# EAGLE design analog-in (EAGLE 9.6.2)
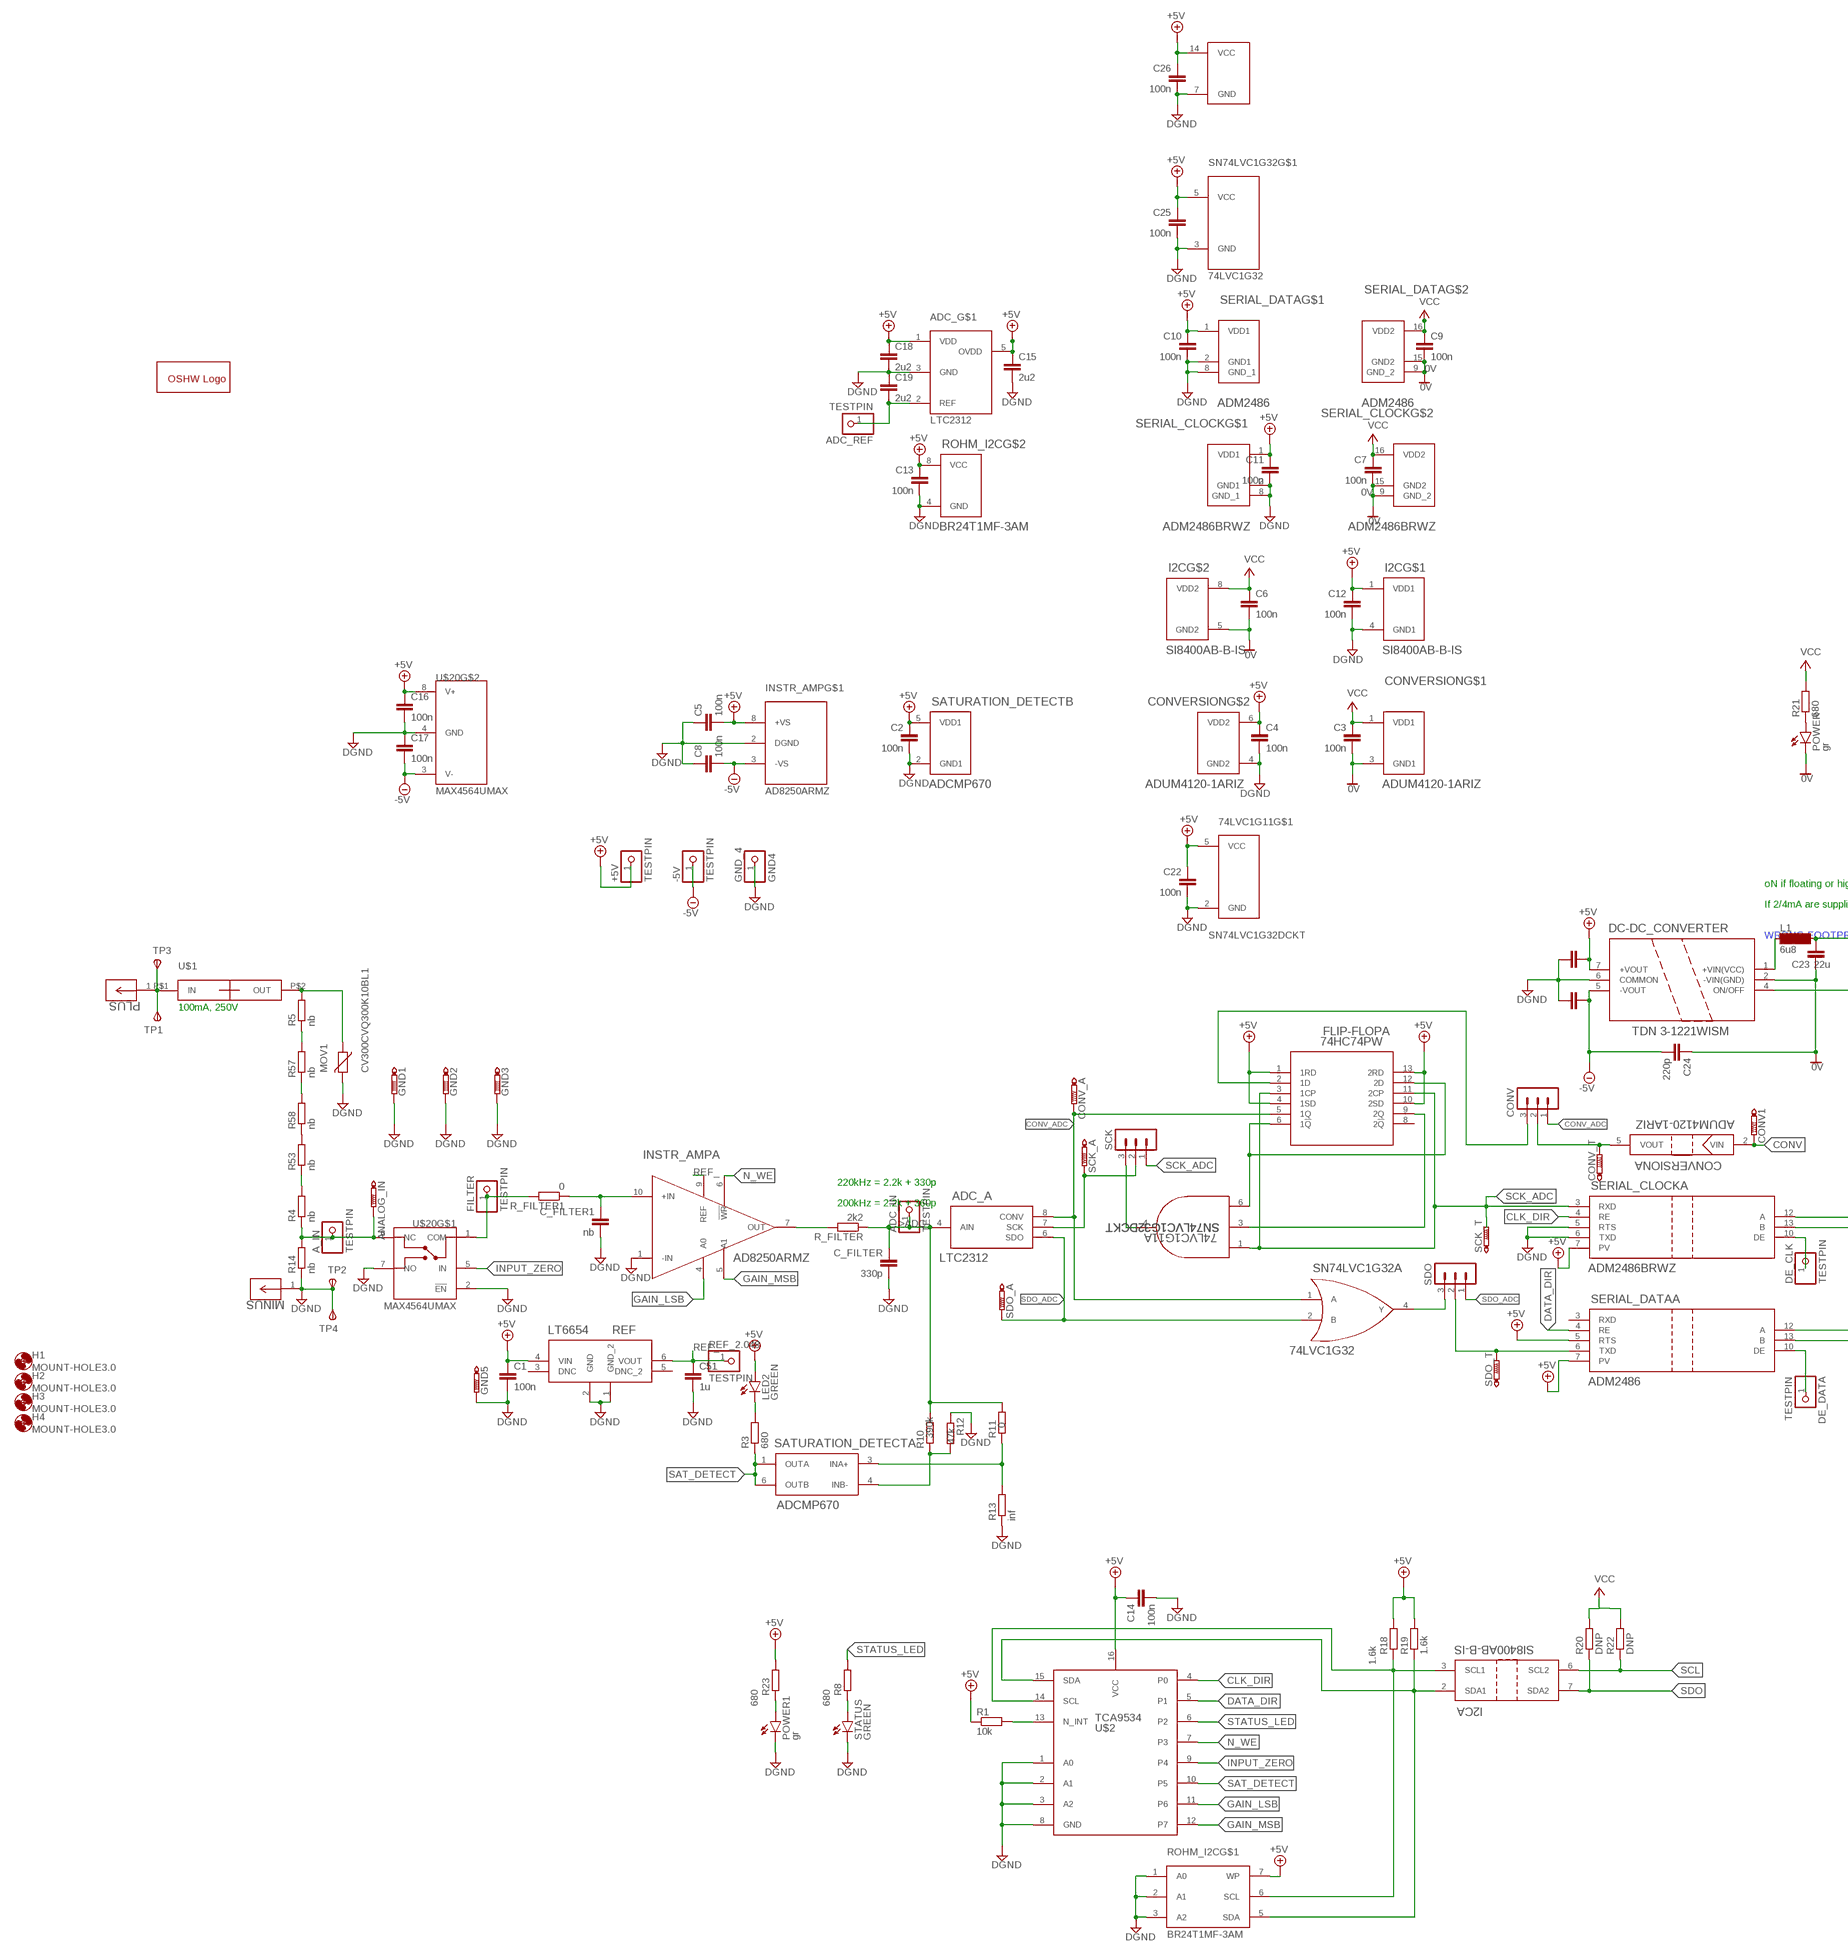
[diagram p0: schematic, sheet 1, part 1 of 2]
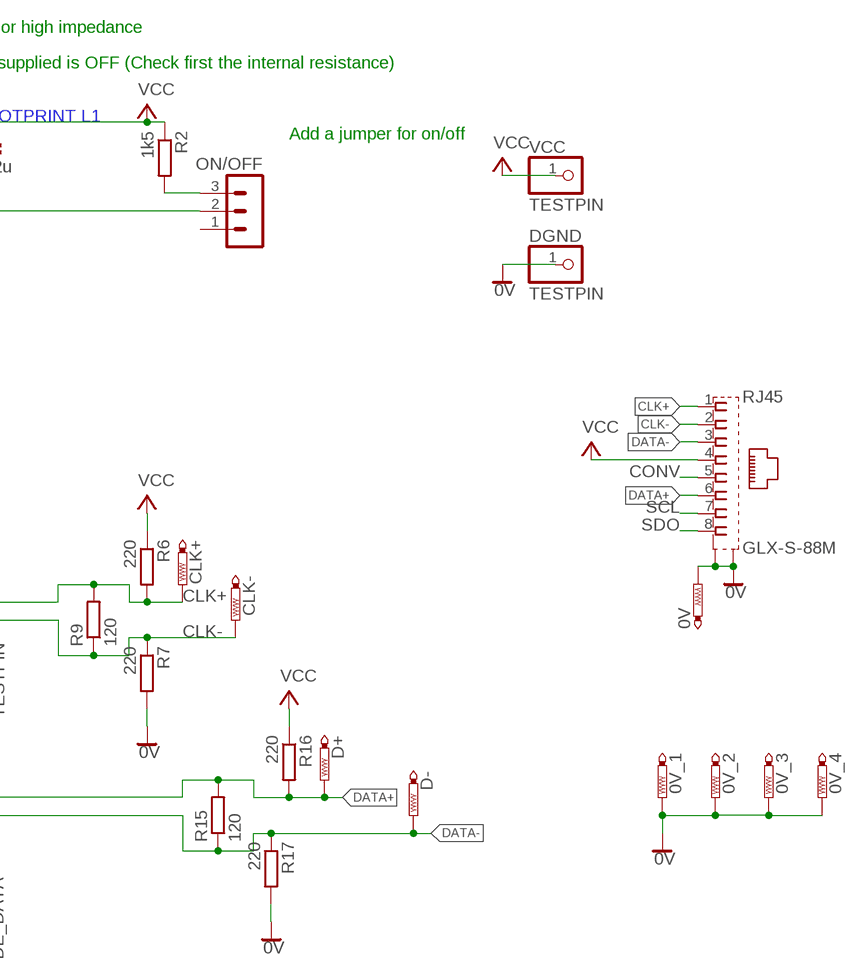
[diagram p1: schematic, sheet 1, part 2 of 2]

## Parts
0V  PTR1B1,27  [B1,27]
0V_1  PTR1B1,27  [B1,27]
0V_2  PTR1B1,27  [B1,27]
0V_3  PTR1B1,27  [B1,27]
0V_4  PTR1B1,27  [B1,27]
74LVC1G11  SN74LVC1G32DCKT  SN74LVC1G11DBVRDBV0006A_L  [DBV0006A_L]
+5V  TESTPIN  [1X01]
-5V  TESTPIN  [1X01]
A_IN  TESTPIN  [1X01]
ADC_  LTC2312  LTC2312ITS8-14TRMPBF  [TSOT-23_TS8_LIT]
ADC_IN  TESTPIN  [1X01]
ADC_REF  TESTPIN  [1X01]
ANALOG_IN  PTR1B1,27  [B1,27]
C1  100n  C-EUC0805  [C0805]
C2  100n  C-EUC0805K  [C0805K]
C3  100n  C-EUC0805K  [C0805K]
C4  100n  C-EUC0805K  [C0805K]
C5  100n  C-EUC0805K  [C0805K]
C6  100n  C-EUC0805K  [C0805K]
C7  100n  C-EUC0805K  [C0805K]
C8  100n  C-EUC0805K  [C0805K]
C9  100n  C-EUC0805K  [C0805K]
C10  100n  C-EUC0805K  [C0805K]
C11  100n  C-EUC0805K  [C0805K]
C12  100n  C-EUC0805K  [C0805K]
C13  100n  C-EUC0805K  [C0805K]
C14  100n  C-EUC0805K  [C0805K]
C15  2u2  C-EUC0805K  [C0805K]
C16  100n  C-EUC0805K  [C0805K]
C17  100n  C-EUC0805K  [C0805K]
C18  2u2  C-EUC0805K  [C0805K]
C19  2u2  C-EUC0805K  [C0805K]
C20  100n  C-EUC0805K  [C0805K]
C21  100n  C-EUC0805K  [C0805K]
C22  100n  C-EUC0805K  [C0805K]
C23  22u  C-EUC1206  [C1206]
C24  220p  C-EUC1808  [C1808]
C25  100n  C-EUC0805K  [C0805K]
C26  100n  C-EUC0805K  [C0805K]
C51  1u  C-EUC0805  [C0805]
C_FILTER  330p  C-EUC0805K  [C0805K]
C_FILTER1  nb  C-EUC0805K  [C0805K]
CLK+  PTR1B1,27  [B1,27]
CLK-  PTR1B1,27  [B1,27]
CONV  MA03-1  [MA03-1]
CONV1  PTR1B1,27  [B1,27]
CONV_A  PTR1B1,27  [B1,27]
CONV_T  PTR1B1,27  [B1,27]
CONVERSION  ADUM4120-1ARIZ  [RI_6_1_ADI]
D+  PTR1B1,27  [B1,27]
D-  PTR1B1,27  [B1,27]
DC-DC_CONVERTER  TDN 3-1221WISM  TDN_3-1211WI  [TDN3_TRP]
DE_CLK  TESTPIN  [1X01]
DE_DATA  TESTPIN  [1X01]
DGND  TESTPIN  [1X01]
FILTER  TESTPIN  [1X01]
FLIP-FLOP  74HC74PW  74HC74PW-Q100,118  [TSSOP14_SOT402-1_NEX]
GND1  PTR1B1,27  [B1,27]
GND2  PTR1B1,27  [B1,27]
GND3  PTR1B1,27  [B1,27]
GND5  PTR1B1,27  [B1,27]
GND_4  GND4  TESTPIN  [1X01]
GOLD_ORB_SM1  OSHWLOGOLOGO8MM  [OSHW_8MM]
H1  MOUNT-HOLE3.0  [3,0]
H2  MOUNT-HOLE3.0  [3,0]
H3  MOUNT-HOLE3.0  [3,0]
H4  MOUNT-HOLE3.0  [3,0]
I2C  SI8400AB-B-IS  ADUM1251WARZ  [R_8_ADI]
INSTR_AMP  AD8250ARMZ  [RM_10_ADI]
L1  6u8  SM-NE29  [SM-NE29]
LED2  GREEN  LEDSML0805  [SML0805]
MINUS  23.3200-21  [CONN_23.3200-21_SBI]
MOV1  CV300CVQ300K10BL1  [CVQ300K10]
ON/OFF  MA03-1  [MA03-1]
PLUS  23.3200-21  [CONN_23.3200-21_SBI]
POWER  gr  LEDSML0805  [SML0805]
POWER1  gr  LEDSML0805  [SML0805]
R1  10k  R-EU_R0805  [R0805]
R2  1k5  R-EU_R0805  [R0805]
R3  680  R-EU_R0805  [R0805]
R4  nb  R-EU_R1206  [R1206]
R5  nb  R-EU_R1206  [R1206]
R6  220  R-EU_R0805  [R0805]
R7  220  R-EU_R0805  [R0805]
R8  680  R-EU_R0805  [R0805]
R9  120  R-EU_R0805  [R0805]
R10  390k  R-EU_R0805  [R0805]
R11  0  R-EU_R0805  [R0805]
R12  47k  R-EU_R0805  [R0805]
R13  inf  R-EU_R0805  [R0805]
R14  nb  R-EU_R0805  [R0805]
R15  120  R-EU_R0805  [R0805]
R16  220  R-EU_R0805  [R0805]
R17  220  R-EU_R0805  [R0805]
R18  1.6k  R-EU_R0805  [R0805]
R19  1.6k  R-EU_R0805  [R0805]
R20  DNP  R-EU_R0805  [R0805]
R21  680  R-EU_R0805  [R0805]
R22  DNP  R-EU_R0805  [R0805]
R23  680  R-EU_R0805  [R0805]
R53  nb  R-EU_R1206  [R1206]
R57  nb  R-EU_R1206  [R1206]
R58  nb  R-EU_R1206  [R1206]
R_FILTER  2k2  R-EU_R0805  [R0805]
R_FILTER1  0  R-EU_R0805  [R0805]
REF  LT6654  LT6654AIS6-2.048TRMPBF  [S_6_ADI]
REF_2.048  TESTPIN  [1X01]
RJ45  GLX-S-88M  [GLX-S-88M]
ROHM_I2C  BR24T1MF-3AM  [BR24T1MFJ-3AM]
SATURATION_DETECT  ADCMP670  ADCMP670-1YUJZ-RL7  [UJ_6_ADI]
SCK  MA03-1  [MA03-1]
SCK_A  PTR1B1,27  [B1,27]
SCK_T  PTR1B1,27  [B1,27]
SDO  MA03-1  [MA03-1]
SDO_A  PTR1B1,27  [B1,27]
SDO_T  PTR1B1,27  [B1,27]
SERIAL_CLOCK  ADM2486BRWZ  ADM2486BRWZ-REEL  [RW_16_ADI]
SERIAL_DATA  ADM2486  ADM2486BRWZ-REEL  [RW_16_ADI]
SN74LVC1G32  74LVC1G32  SN74LVC1G32DCKTDCK5-M  [DCK5-M]
STATUS  GREEN  LEDCHIPLED_0805  [CHIPLED_0805]
TP1  TPSTP20SQ  [TP20SQ]
TP2  TPSTP20SQ  [TP20SQ]
TP3  TPSTP20SQ  [TP20SQ]
TP4  TPSTP20SQ  [TP20SQ]
U$1  0508.500MXEP  [0508.500MXEP]
U$2  TCA9534  [TSSOP16L]
U$20  MAX4564UMAX  [UMAX8]
VCC  TESTPIN  [1X01]

## Nets
0V: 0V.TP 0V_1.TP 0V_2.TP 0V_3.TP 0V_4.TP C3.2 C6.2 C7.2 C9.2 C23.1 C24.1 CONVERSION.3(GND1) DC-DC_CONVERTER.2(-VIN(GND)) DGND.1 I2C.5(GND2) POWER.C R7.2 R17.2 RJ45.S1 RJ45.S2 SERIAL_CLOCK.9(GND_2) SERIAL_CLOCK.15(GND2) SERIAL_DATA.9(GND_2) SERIAL_DATA.15(GND2)
+5V: 74LVC1G11.5(VCC) +5V.1 ADC_.1(VDD) ADC_.5(OVDD) C1.1 C2.1 C4.1 C5.2 C10.1 C11.1 C12.1 C13.1 C14.1 C15.1 C16.1 C18.1 C20.2 C22.1 C25.1 C26.1 CONVERSION.6(VDD2) DC-DC_CONVERTER.7(+VOUT) FLIP-FLOP.1(A:1RD) FLIP-FLOP.4(A:1SD) FLIP-FLOP.10(A:2SD) FLIP-FLOP.13(A:2RD) FLIP-FLOP.14(SUPPLY:VCC) I2C.1(VDD1) INSTR_AMP.8(+VS) LED2.A R1.1 R18.2 R19.2 R23.2 REF.4(VIN) ROHM_I2C.7(WP) ROHM_I2C.8(VCC) SATURATION_DETECT.5(B:VDD1) SERIAL_CLOCK.1(VDD1) SERIAL_CLOCK.7(A:PV) SERIAL_DATA.1(VDD1) SERIAL_DATA.5(A:RTS) SERIAL_DATA.7(A:PV) SN74LVC1G32.5(VCC) U$2.16(VCC) U$20.8(V+)
-5V: -5V.1 C8.2 C17.2 C21.2 C24.2 DC-DC_CONVERTER.5(-VOUT) INSTR_AMP.3(-VS) U$20.3(V-)
>ADC: ADC_.4(A:AIN) ADC_IN.1 C_FILTER.1 R10.2 R11.2 R_FILTER.1
CLK+: CLK+.TP R6.2 R9.2 RJ45.1 SERIAL_CLOCK.12(A:A)
CLK-: CLK-.TP R7.1 R9.1 RJ45.2 SERIAL_CLOCK.13(A:B)
CLK_DIR: SERIAL_CLOCK.4(A:RE) U$2.4(P0)
CONV: CONV1.TP CONVERSION.2(A:VIN) RJ45.5
CONV_ADC: ADC_.8(A:CONV) CONV.1 CONV_A.TP FLIP-FLOP.5(A:1Q) SN74LVC1G32.1(A:A)
DATA+: D+.TP R15.2 R16.2 RJ45.6 SERIAL_DATA.12(A:A)
DATA-: D-.TP R15.1 R17.1 RJ45.3 SERIAL_DATA.13(A:B)
DATA_DIR: SERIAL_DATA.4(A:RE) U$2.5(P1)
DGND: 74LVC1G11.2(GND) ADC_.3(GND) C1.2 C2.2 C4.2 C5.1 C8.1 C10.2 C11.2 C12.2 C13.2 C14.2 C15.2 C16.2 C17.1 C18.2 C19.1 C20.1 C21.1 C22.2 C25.2 C26.2 C51.2 C_FILTER1.2 C_FILTER.2 CONVERSION.4(GND2) DC-DC_CONVERTER.6(COMMON) FLIP-FLOP.7(SUPPLY:GND) GND1.TP GND2.TP GND3.TP GND5.TP GND_4.1 I2C.4(GND1) INSTR_AMP.1(A:-IN) INSTR_AMP.2(DGND) MINUS.1 MOV1.2 POWER1.C R12.1 R13.1 R14.1 REF.1(GND_2) REF.2(GND) ROHM_I2C.1(A0) ROHM_I2C.2(A1) ROHM_I2C.3(A2) ROHM_I2C.4(GND) SATURATION_DETECT.2(B:GND1) SERIAL_CLOCK.2(GND1) SERIAL_CLOCK.5(A:RTS) SERIAL_CLOCK.6(A:TXD) SERIAL_CLOCK.8(GND_1) SERIAL_DATA.2(GND1) SERIAL_DATA.8(GND_1) SN74LVC1G32.3(GND) STATUS.C TP2.TP(PP) TP4.TP(PP) U$2.1(A0) U$2.2(A1) U$2.3(A2) U$2.8(GND) U$20.2(!EN) U$20.4(GND) U$20.7(NO)
GAIN_LSB: INSTR_AMP.4(A:A0) U$2.11(P6)
GAIN_MSB: INSTR_AMP.5(A:A1) U$2.12(P7)
INPUT_ZERO: U$2.9(P4) U$20.5(IN)
N$1: INSTR_AMP.7(A:OUT) R_FILTER.2
N$2: R1.2 U$2.13(N_INT)
N$3: DE_CLK.1 SERIAL_CLOCK.10(A:DE)
N$4: I2C.3(A:SCL1) R18.1 ROHM_I2C.6(SCL) U$2.14(SCL)
N$5: FILTER.1 R_FILTER1.2 U$20.1(COM)
N$6: I2C.2(A:SDA1) R19.1 ROHM_I2C.5(SDA) U$2.15(SDA)
N$7: DE_DATA.1 SERIAL_DATA.10(A:DE)
N$8: ADC_.2(REF) ADC_REF.1 C19.2
N$9: MOV1.1 R5.2 U$1.P$2(OUT)
N$10: DC-DC_CONVERTER.1(+VIN(VCC)) L1.1
N$11: ON/OFF.3 R2.2
N$12: DC-DC_CONVERTER.4(ON/OFF) ON/OFF.2
N$13: 74LVC1G11.4(A:Y) SCK.3
N$14: LED2.C R3.2
N$15: C_FILTER1.1 INSTR_AMP.10(A:+IN) R_FILTER1.1
N$16: PLUS.1 TP1.TP(PP) TP3.TP(PP) U$1.P$1(IN)
N$17: R10.1 R12.2 SATURATION_DETECT.4(A:INB-)
N$18: R11.1 R13.2 SATURATION_DETECT.3(A:INA+)
N$19: 74LVC1G11.6(A:C) FLIP-FLOP.6(A:1!Q) FLIP-FLOP.12(A:2D)
N$20: A_IN.1 ANALOG_IN.TP R4.1 R14.2 U$20.6(NC)
N$21: R57.1 R58.2
N$22: R8.1 STATUS.A
N$23: 74LVC1G11.3(A:B) FLIP-FLOP.9(A:2Q)
N$24: CONV.2 CONV_T.TP CONVERSION.5(A:VOUT)
N$25: CONV.3 FLIP-FLOP.2(A:1D)
N$26: ADC_.7(A:SCK) SCK.2 SCK_A.TP
N$27: POWER1.A R23.1
N$29: R4.2 R53.1
N$30: SDO.2 SDO_T.TP SERIAL_DATA.6(A:TXD)
N$31: SDO.3 SN74LVC1G32.4(A:Y)
N$53: POWER.A R21.1
N$66: R53.2 R58.1
N$67: R5.1 R57.2
N_WE: INSTR_AMP.6(A:!WR) U$2.7(P3)
REF_: C51.1 INSTR_AMP.9(A:REF) REF.6(VOUT) REF_2.048.1
SAT_DETECT: R3.1 SATURATION_DETECT.1(A:OUTA) SATURATION_DETECT.6(A:OUTB) U$2.10(P5)
SCK_ADC: 74LVC1G11.1(A:A) FLIP-FLOP.3(A:1CP) FLIP-FLOP.11(A:2CP) SCK.1 SCK_T.TP SERIAL_CLOCK.3(A:RXD)
SCL: I2C.6(A:SCL2) R22.1 RJ45.7
SDO: I2C.7(A:SDA2) R20.1 RJ45.8
SDO_ADC: ADC_.6(A:SDO) SDO.1 SDO_A.TP SN74LVC1G32.2(A:B)
STATUS_LED: R8.2 U$2.6(P2)
V+: C3.1 C6.1 C7.1 C9.1 C23.2 CONVERSION.1(VDD1) I2C.8(VDD2) L1.2 R2.1 R6.1 R16.1 R20.2 R21.2 R22.2 RJ45.4 SERIAL_CLOCK.16(VDD2) SERIAL_DATA.16(VDD2) VCC.1 ; supply symbol labelled VCC
Unconnected: FLIP-FLOP.8(A:2!Q) ON/OFF.1 REF.3(DNC) REF.5(DNC_2) SERIAL_DATA.3(A:RXD)

## Notes on the sheet
- oN if floating or high impedance
- If 2/4mA are supplied is OFF (Check first the internal resistance)
- WRONG FOOTPRINT L1
- Add a jumper for on/off
- 100mA, 250V
- 220kHz = 2.2k + 330p
- 200kHz = 2.2k + 360p

## Library data of the parts
0V 0V_1-0V_4 ANALOG_IN CLK+ CLK- CONV1 CONV_A CONV_T D+ D- GND1-GND3 GND5 SCK_A SCK_T SDO_A SDO_T = testpad:PTR1: TEST PIN
74LVC1G11 = 74LVC1G11DBV:SN74LVC1G11DBVR; APPLICATION_BUILDNUMBER: *; COMPTYPE: IC; MANUFACTURER: Texas Instruments; MOUNTTYPE: SMT; PACKAGEREFERENCE: DBV0006A; PARTNUMBER: SN74LVC1G11DBVR; PIN_COUNT: 6; REFDES: RefDes; ROHS: Y; TYPE: TYPE; VALUE: Value
+5V -5V A_IN ADC_IN ADC_REF DE_CLK DE_DATA DGND FILTER GND_4 REF_2.048 VCC = myLib:TESTPIN
ADC_ = LTC2312-14:LTC2312ITS8-14TRMPBF; BUILT_BY: EMA_UL_Team; DIGIKEY: LTC2312CTS8-14#TRMPBFTR-ND; MANUFACTURER_PART_NUMBER: LTC2312ITS8-14#TRMPBF; SOURCELIBRARY: LinearTech_2016-05-13_6; VENDOR: Linear Technology
C1 = rcl:C-EU: CAPACITOR, European symbol; DIGIKEY: 478-7962-1-ND; MOUSER: 81-GRM21BZ71E106KE5L; SPICEPREFIX: C
C2-C14 C16 C17 C20-C22 C25 C26 = rcl:C-EU: CAPACITOR, European symbol; DIGIKEY: 478-7962-1-ND; SPICEPREFIX: C
C15 C18 C19 = rcl:C-EU: CAPACITOR, European symbol; DIGIKEY: 1276-2954-2-ND; SPICEPREFIX: C
C23 = rcl:C-EU: CAPACITOR, European symbol; DIGIKEY: 399-17625-1-ND; SPICEPREFIX: C
C24 = rcl:C-EU: CAPACITOR, European symbol; DIGIKEY: 478-10448-2-ND; SPICEPREFIX: C
C51 = rcl:C-EU: CAPACITOR, European symbol; DIGIKEY: 1276-6471-1-ND; MOUSER: 81-GRM21BZ71E106KE5L; SPICEPREFIX: C
C_FILTER = rcl:C-EU: CAPACITOR, European symbol; DIGIKEY: 478-9885-1-ND; SPICEPREFIX: C
C_FILTER1 = rcl:C-EU: CAPACITOR, European symbol; DIGIKEY: 478-08055C121KAT2ACT-ND; SPICEPREFIX: C
CONV ON/OFF SCK SDO = con-lstb:MA03-1: PIN HEADER; DIGIKEY: 732-5316-ND; OC_FARNELL: unknown; OC_NEWARK: unknown
CONVERSION = ADUM4120:ADUM4120-1ARIZ; BUILT_BY: Analog Devices Inc.; DIGIKEY: ADUM4120-1ARIZ-ND; MANUFACTURER_PART_NUMBER: ADUM4120-1ARIZ; SOURCELIBRARY: Analog_2017-10-24; VENDOR: Analog Devices Inc
DC-DC_CONVERTER = TDN3-1221WISM:TDN_3-1211WI; BUILT_BY: EMA_Justin; COPYRIGHT: Copyright (C) 2018 Accelerated Designs. All rights reserved; DIGIKEY: TDN3-1221WISM-ND; MANUFACTURER_PART_NUMBER: TDN 3-1221WISM; SOURCELIBRARY: Traco_Power_2020-05-19; VENDOR: Traco Power
FLIP-FLOP = 74H74PW:74HC74PW-Q100,118; BUILT_BY: EMA_Cory; COPYRIGHT: Copyright (C) 2018 Accelerated Designs. All rights reserved; DATASHEET: https://assets.nexperia.com/documents/data-sheet/74HC_HCT74_Q100.pdf; DIGIKEY: 1727-4083-1-ND; MANUFACTURER_PART_NUMBER: 74HC74PW-Q100,118; SOURCELIBRARY: Nexperia_2020-08-04; VENDOR: Nexperia
GOLD_ORB_SM1 = oshw:OSHWLOGO: The OSHW logo for PCB layout
H1-H4 = holes:MOUNT-HOLE: MOUNTING HOLE with drill center marker
I2C = ADUM1251WARZ:ADUM1251WARZ; BUILT_BY: EMA_UL_Team; COPYRIGHT: Copyright (C) 2018 Accelerated Designs. All rights reserved; DIGIKEY: ADUM1251ARZ-RL7TR-ND; MANUFACTURER_PART_NUMBER: ADUM1251WARZ; SOURCELIBRARY: Analog_2019-03-08; VENDOR: Analog Devices Inc
INSTR_AMP = parts:AD8250ARMZ; BUILT_BY: EMA_UL_Team; DIGIKEY: AD8250ARMZ-R7TR-ND; MANUFACTURER_PART_NUMBER: AD8250ARMZ; SOURCELIBRARY: Analog_2015-12-15; VENDOR: Analog Devices Inc
L1 = inductor-neosid:SM-NE29: INDUCTOR SMD chip inductor; DIGIKEY: 1951-1045-ND; OC_FARNELL: unknown; OC_NEWARK: unknown
LED2 POWER POWER1 STATUS = led:LED: LED OSRAM: - CHIPLED LG R971, LG N971, LY N971, LG Q971, LY Q971, LO R971, LY R971 LH N974, LH R974 LS Q976, LO Q976, LY Q976 LO Q996 - Hyper CHIPLED LW Q18S LB Q993, LB Q99A, LB R99A - SideLED LS A670, LO A670, LY A670, LG A670, LP A670 LB A673, LV A673, LT A673, LW A673 LH A674 LY A675 LS A676, LA A676, LO A676, LY A676, LW A676 LS A679, LY A679, LG A679 - Hyper Micro SIDELED® LS Y876, LA Y876, LO Y876, LY Y876 LT Y87S - SmartLED LW L88C, LW L88S LB L89C, LB L89S, LG L890 LS L89K, LO L89K, LY L89K LS L896, LA L896, LO L896, LY L896 - TOPLED LS T670, LO T670, LY T670, LG T670, LP T670 LSG T670, LSP T670, LSY T670, LOP T670, LYG T670 LG T671, LOG T671, LSG T671 LB T673, LV T673, LT T673, LW T673 LH T674 LS T676, LA T676, LO T676, LY T676, LB T676, LH T676, LSB T676, LW T676 LB T67C, LV T67C, LT T67C, LS T67K, LO T67K, LY T67K, LW E67C LS E67B, LA E67B, LO E67B, LY E67B, LB E67C, LV E67C, LT E67C LW T67C LS T679, LY T679, LG T679 LS T770, LO T770, LY T770, LG T770, LP T770 LB T773, LV T773, LT T773, LW T773 LH T774 LS E675, LA E675, LY E675, LS T675 LS T776, LA T776, LO T776, LY T776, LB T776 LHGB T686 LT T68C, LB T68C - Hyper Mini TOPLED® LB M676 - Mini TOPLED Santana® LG M470 LS M47K, LO M47K, LY M47K Source: http://www.osram.convergy.de LUXEON: - LUMILED® LXK2-PW12-R00, LXK2-PW12-S00, LXK2-PW14-U00, LXK2-PW14-V00 LXK2-PM12-R00, LXK2-PM12-S00, LXK2-PM14-U00 LXK2-PE12-Q00, LXK2-PE12-R00, LXK2-PE12-S00, LXK2-PE14-T00, LXK2-PE14-U00 LXK2-PB12-K00, LXK2-PB12-L00, LXK2-PB12-M00, LXK2-PB14-N00, LXK2-PB14-P00, LXK2-PB14-Q00 LXK2-PR12-L00, LXK2-PR12-M00, LXK2-PR14-Q00, LXK2-PR14-R00 LXK2-PD12-Q00, LXK2-PD12-R00, LXK2-PD12-S00 LXK2-PH12-R00, LXK2-PH12-S00 LXK2-PL12-P00, LXK2-PL12-Q00, LXK2-PL12-R00 Source: www.luxeon.com KINGBRIGHT: KA-3528ASYC Source: www.kingbright.com; DIGIKEY: LTST-C170GKT
MINUS = CONN_BANANA_JACK_4MM_STAUBLI:23.3200-21; BUILT_BY: EMA_Cory; COPYRIGHT: Copyright (C) 2018 Accelerated Designs. All rights reserved; DIGIKEY: 501-73099-0-ND; MANUFACTURER_PART_NUMBER: 23.3200-21; SOURCELIBRARY: Staubli_2020-01-16; VENDOR: Stäubli
MOV1 = myLib:CV300
PLUS = CONN_BANANA_JACK_4MM_STAUBLI:23.3200-21; BUILT_BY: EMA_Cory; COPYRIGHT: Copyright (C) 2018 Accelerated Designs. All rights reserved; DIGIKEY: 501-73099-2-ND; MANUFACTURER_PART_NUMBER: 23.3200-21; SOURCELIBRARY: Staubli_2020-01-16; VENDOR: Stäubli
R1 = rcl:R-EU_: RESISTOR, European symbol; DIGIKEY: P10KDATR-ND; MOUSER: 652-CR0805JW-561ELF; SPICEPREFIX: R
R2 = rcl:R-EU_: RESISTOR, European symbol; DIGIKEY: P1.5KDATR-ND; SPICEPREFIX: R
R3 R21 = rcl:R-EU_: RESISTOR, European symbol; DIGIKEY: A129747TR-ND; MOUSER: 652-CR0805JW-561ELF; SPICEPREFIX: R
R4 R5 R14 R53 R57 R58 = rcl:R-EU_: RESISTOR, European symbol; MOUSER: check config; SPICEPREFIX: R
R6 R7 R16 R17 = rcl:R-EU_: RESISTOR, European symbol; DIGIKEY: Y1624195R000Q9R-ND; SPICEPREFIX: R
R8 R18-R20 R22 R23 = resistor:R-EU_: RESISTOR, European symbol
R9 R15 = rcl:R-EU_: RESISTOR, European symbol; DIGIKEY: Y1629-120DTR-ND; SPICEPREFIX: R
R10 = rcl:R-EU_: RESISTOR, European symbol; DIGIKEY: 2019-RK73H2ATTD3903FTR-ND; SPICEPREFIX: R
R11 = rcl:R-EU_: RESISTOR, European symbol; DIGIKEY: RMCF0805ZT0R00TR-ND; SPICEPREFIX: R
R12 = rcl:R-EU_: RESISTOR, European symbol; DIGIKEY: A130144TR-ND; SPICEPREFIX: R
R13 = rcl:R-EU_: RESISTOR, European symbol; SPICEPREFIX: R
R_FILTER = rcl:R-EU_: RESISTOR, European symbol; DIGIKEY: A106060TR-ND; SPICEPREFIX: R
R_FILTER1 = rcl:R-EU_: RESISTOR, European symbol; DIGIKEY: P220DACT-ND; SPICEPREFIX: R
REF = LT6654AIS6-2.048:LT6654AIS6-2.048TRMPBF; BUILT_BY: EMA_Jessica; COPYRIGHT: Copyright (C) 2016 Accelerated Designs. All rights reserved; DIGIKEY: 161-LT6654BHS6-2.048#WTRPBFTR-ND; MANUFACTURER_PART_NUMBER: LT6654AIS6-2.048#TRMPBF; SOURCELIBRARY: Analog_Devices_2018-09-28; VENDOR: Analog Devices Inc
RJ45 = con-kycon:GLX-S-88M: Mod. Jack, Right Angle, 8 posiotion, 8 contatcs RJ45 Source: GLX-S-88M.pdf; DIGIKEY: 2092-GLX-S-88M-ND; OC_FARNELL: unknown; OC_NEWARK: unknown
ROHM_I2C = BR24T1MFJ-3AM:BR24T1MF-3AM; DIGIKEY: BR24T1MF-3AME2TR-ND
SATURATION_DETECT = ADCMP670:ADCMP670-1YUJZ-RL7; BUILT_BY: EMA_UL_Team; DIGIKEY: ADCMP670-1YUJZ-RL7TR-ND; MANUFACTURER_PART_NUMBER: ADCMP670-1YUJZ-RL7; SOURCELIBRARY: Analog_2015-01-06; VENDOR: Analog Devices Inc
SERIAL_CLOCK SERIAL_DATA = ADM2486:ADM2486BRWZ-REEL; BUILT_BY: EMA_UL_Team; DIGIKEY: ADM2486BRWZ-REELTR-ND; MANUFACTURER_PART_NUMBER: ADM2486BRWZ-REEL; SOURCELIBRARY: Analog_2012-01-01_7; VENDOR: Analog Devices Inc
SN74LVC1G32 = SN74LVC1G32:SN74LVC1G32DCKT; DATASHEET_URL: http://www.ti.com/lit/gpn/SN74LVC1G32; DESCRIPTION: Single 2-Input Positive-OR Gate; FAMILY_NAME: LL OR GATE; GENERIC_PART_NUMBER: SN74LVC1G32; INDUSTRY_STD_PKG_TYPE: SC70; MANUFACTURER: Texas Instruments; MANUFACTURER_PART_NUMBER: SN74LVC1G32DCKT; PACKAGE_DESIGNATOR: DCK; PIN_COUNT: 5; VENDOR: Texas Instruments
TP1-TP4 = CONN_smd:TPS: TEST PIN
U$1 = 0508.500MXEP.FUSE:0508.500MXEP; DIGIKEY: 283-4458-1-ND
U$2 = parts:TCA9534
U$20 = myLib:MAX4564UMAX; DIGIKEY: MAX4564EUA+TR-ND; MOUSER: 700-MAX4564EUA

## Net classes
3 FPGA: clearance 0.152 mm to class 0, clearance 7.112 mm to class 1, clearance 3.785 mm to class 2, clearance 0.152 mm

## Board
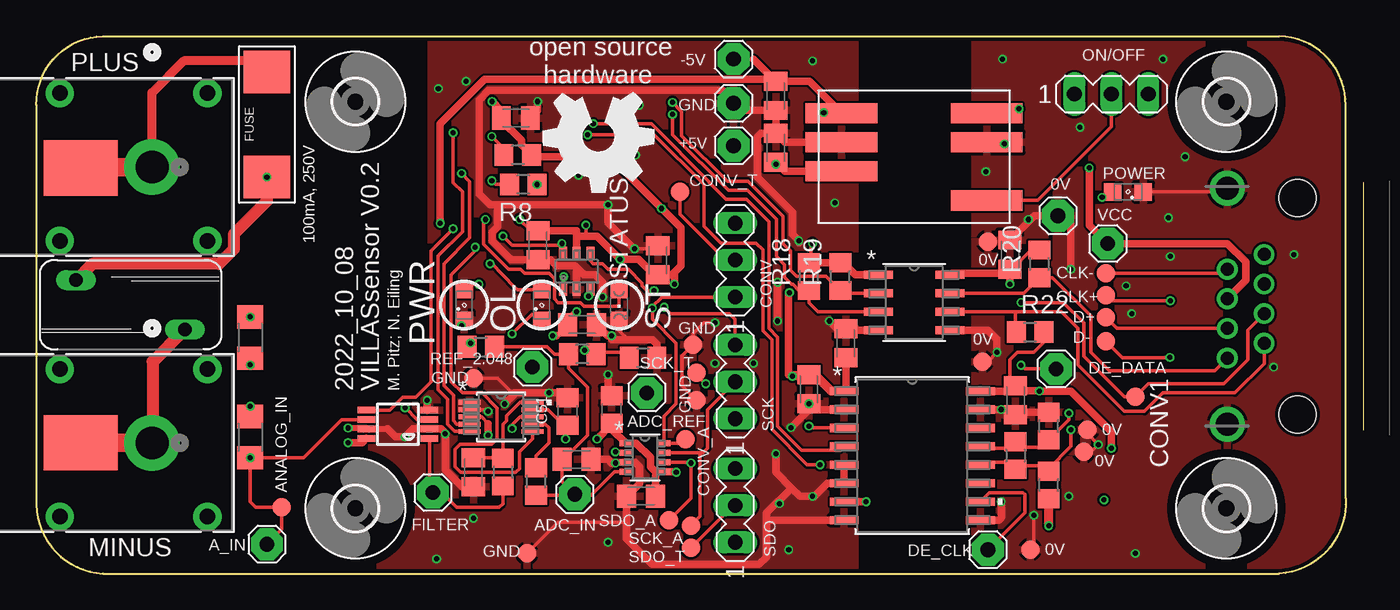
[diagram p2: board, top side]
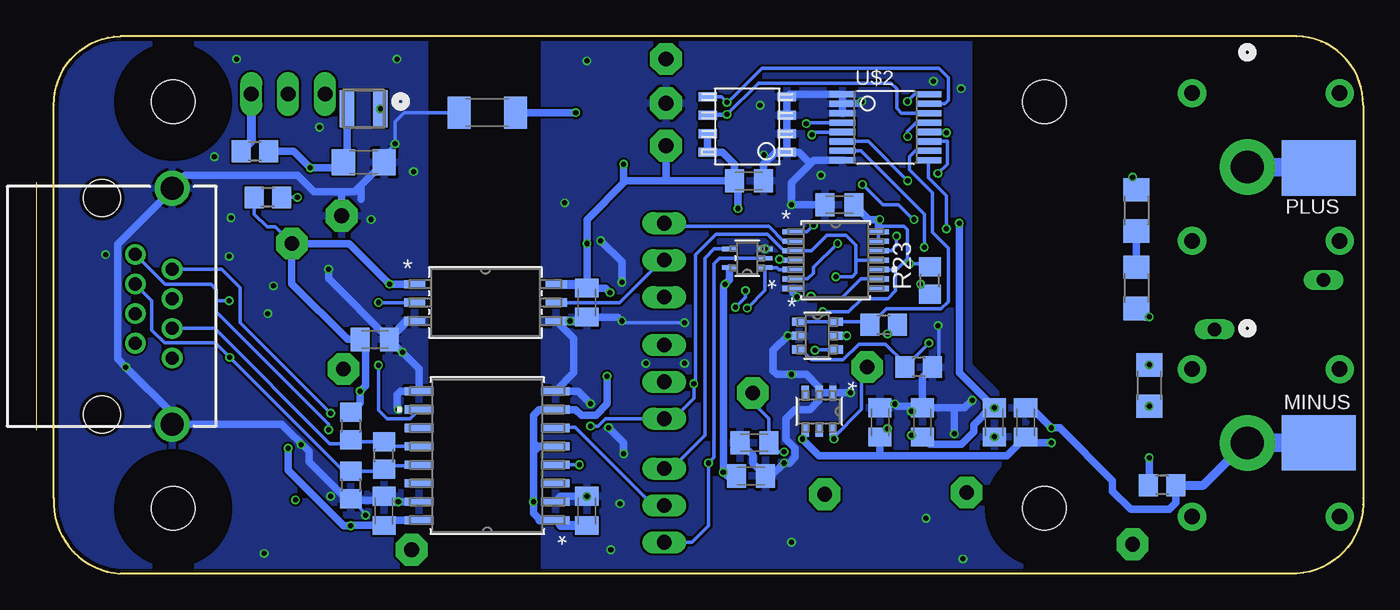
[diagram p3: board, bottom side, seen from below]

Size 90.19 x 37 mm. Coordinates in mm from the lower left corner, seen from the top.
Outline: 0.01,32.26 arc-90 4.58,37 85.61,37 arc-90 90.18,32.26 90.18,5.21 arc-90 85.61,0 4.58,0 arc-90 0.01,5.21 0.01,32.26
Copper layers (1*16): Top 0.018mm / dielectric 1.55mm / Bottom 0.018mm
Design rules "eC_2Layer_PClass6_BaseCopperO18_eCDefault": minimum track width 0.15mm, minimum drill 0.35mm, track to track 0.15mm, track to pad 0.15mm, pad to pad 0.15mm, via to via 0.15mm, smd to smd 0mil, copper to edge 0.25mm, drill to drill 0.35mm, minimum pad ring 0.175mm, minimum via ring 0.125mm, stop-mask expansion 0mil, vias tented up to drill 0.45mm, thermal gap 0.2mm

### Footprints (pad centres in the part's own frame; a part is rotated, then mirrored left to right if it is on the bottom)
B1,27 = smd 1.27 x 1.27: TP 0,0
DBV0006A_L = smd 0.8 x 0.55: 1 -1.275,0.95; 2 -1.275,0; 3 -1.275,-0.95; 4 1.275,-0.95; 5 1.275,0; 6 1.275,0.95
1X01 = drill 1.016 pad 2.184 octagon: 1 0,0
TSOT-23_TS8_LIT = smd 0.876 x 0.406: 1 -1.314,0.975; 2 -1.314,0.325; 3 -1.314,-0.325; 4 -1.314,-0.975; 5 1.314,-0.975; 6 1.314,-0.325; 7 1.314,0.325; 8 1.314,0.975
C0805 = smd 1.3 x 1.5: 1 -0.95,0; 2 0.95,0
C0805K = smd 1.3 x 1.6: 1 -1,0; 2 1,0
C1206 = smd 1.6 x 1.8: 1 -1.4,0; 2 1.4,0
C1808 = smd 1.6 x 2.2: 1 -1.95,0; 2 1.95,0
MA03-1 = drill 1.016 long: 1 -2.54,0; 2 0,0; 3 2.54,0
RI_6_1_ADI = smd 1.461 x 0.561: 1 -4.88,1.27; 2 -4.88,0; 3 -4.88,-1.27; 4 4.88,-1.27; 5 4.88,0; 6 4.88,1.27
TDN3_TRP = smd 4.95 x 1.397: 1 -5,-3; 2 -5,-1; 4 -5,3; 5 5,-3; 6 5,-1; 7 5,1
TSSOP14_SOT402-1_NEX = smd 1.41 x 0.356: 1 -2.953,1.95; 2 -2.953,1.3; 3 -2.953,0.65; 4 -2.953,0; 5 -2.953,-0.65; 6 -2.953,-1.3; 7 -2.953,-1.95; 8 2.953,-1.95; 9 2.953,-1.3; 10 2.953,-0.65; 11 2.953,0; 12 2.953,0.65; 13 2.953,1.3; 14 2.953,1.95
3,0 = hole 3: 0,0
R_8_ADI = smd 1.981 x 0.559: 1 -2.464,1.905; 2 -2.464,0.635; 3 -2.464,-0.635; 4 -2.464,-1.905; 5 2.464,-1.905; 6 2.464,-0.635; 7 2.464,0.635; 8 2.464,1.905
RM_10_ADI = smd 1.524 x 0.33: 1 -2.172,1; 2 -2.172,0.5; 3 -2.172,0; 4 -2.172,-0.5; 5 -2.172,-1; 6 2.172,-1; 7 2.172,-0.5; 8 2.172,0; 9 2.172,0.5; 10 2.172,1
SM-NE29 = smd 1 x 2.54: 1 -1.15,0; 2 1.15,0
SML0805 = smd 1.2 x 1.2: A 1.05,0; C -1.05,0
CONN_23.3200-21_SBI = drill 2.261 pad 3.81: 1 0,0 | drill 1.067 pad 1.93: 2 -5.08,3.81; 3 5.08,3.81; 4 -5.08,-6.35; 5 5.08,-6.35
CVQ300K10 = drill 0.914 long: 1 -1.702,-3.747; 2 1.702,3.747
R0805 = smd 1.3 x 1.5: 1 -0.95,0; 2 0.95,0
R1206 = smd 1.6 x 1.803: 1 -1.422,0; 2 1.422,0
S_6_ADI = smd 0.94 x 0.508: 1 -1.283,0.95; 2 -1.283,0; 3 -1.283,-0.95; 4 1.283,-0.95; 5 1.283,0; 6 1.283,0.95
GLX-S-88M = drill 0.9 pad 1.422: 1 -3.57,-2.3; 2 -2.55,-4.84; 3 -1.53,-2.3; 4 -0.51,-4.84; 5 0.51,-2.3; 6 1.53,-4.84; 7 2.55,-2.3; 8 3.57,-4.84 | drill 1.6 pad 2.184: S1 -8.125,-4.84; S2 8.125,-4.84 | hole 2.55: -7.44,0; 7.44,0
BR24T1MFJ-3AM = smd 0.635 x 1.27: 1 -1.714,-2.731; 2 -0.445,-2.731; 3 0.826,-2.731; 4 2.095,-2.731; 5 2.095,2.731; 6 0.826,2.731; 7 -0.445,2.731; 8 -1.714,2.731
UJ_6_ADI = smd 0.953 x 0.559: 1 -1.276,0.95; 2 -1.276,0; 3 -1.276,-0.95; 4 1.276,-0.95; 5 1.276,0; 6 1.276,0.95
RW_16_ADI = smd 1.981 x 0.559: 1 -4.686,4.445; 2 -4.686,3.175; 3 -4.686,1.905; 4 -4.686,0.635; 5 -4.686,-0.635; 6 -4.686,-1.905; 7 -4.686,-3.175; 8 -4.686,-4.445; 9 4.686,-4.445; 10 4.686,-3.175; 11 4.686,-1.905; 12 4.686,-0.635; 13 4.686,0.635; 14 4.686,1.905; 15 4.686,3.175; 16 4.686,4.445
DCK5-M = smd 1.054 x 0.305: 1 -1.226,0.65; 2 -1.226,0; 3 -1.226,-0.65; 4 1.226,-0.65; 5 1.226,0.65
CHIPLED_0805 = smd 1.2 x 1.2: A 0,-1.05; C 0,1.05
TP20SQ = smd 5.08 x 3.81: TP 0,0
0508.500MXEP = smd 2.921 x 3.2: P$1 -3.302,0.254; P$2 3.937,0.254
TSSOP16L = smd 0.42 x 1.78: 1 -2.275,-2.97; 2 -1.625,-2.97; 3 -0.975,-2.97; 4 -0.325,-2.97; 5 0.325,-2.97; 6 0.975,-2.97; 7 1.625,-2.97; 8 2.275,-2.97; 9 2.275,2.97; 10 1.625,2.97; 11 0.975,2.97; 12 0.325,2.97; 13 -0.325,2.97; 14 -0.975,2.97; 15 -1.625,2.97; 16 -2.275,2.97
UMAX8 = smd 0.45 x 1.2: 1 -0.975,-2.175; 2 -0.325,-2.175; 3 0.325,-2.175; 4 0.975,-2.175; 5 0.975,2.175; 6 0.325,2.175; 7 -0.325,2.175; 8 -0.975,2.175

### Placement (x,y rotation side)
0V  68.46,1.65 90 top
0V_1  65.54,22.86 0 top
0V_2  65.16,14.61 0 top
0V_3  72.14,8.38 0 top
0V_4  72.4,9.91 0 top
74LVC1G11  37.22,20.83 90 top
+5V  48.01,29.46 0 top
-5V  48.01,35.43 0 top
A_IN  15.88,2.03 0 top
ADC_  41.92,8 0 top
ADC_IN  37.09,5.46 90 top
ADC_REF  42.05,12.45 0 top
ANALOG_IN  16.9,4.57 0 top
C1  39.63,11.3 90 top
C2  37.6,17.14 0 top
C3  68.08,16.13 0 bottom
C4  53.48,18.67 270 bottom
C5  33.28,10.41 270 bottom
C6  67.06,21.97 90 top
C7  67.45,11.94 270 top
C8  30.36,10.41 270 bottom
C9  67.45,4.32 90 bottom
C10  53.48,4.32 90 bottom
C11  53.22,12.7 270 top
C12  55.76,15.88 90 top
C13  42.3,27.05 0 bottom
C14  33.03,31.37 0 top
C15  42.17,6.73 0 bottom
C16  23.25,10.41 90 bottom
C17  25.41,10.41 90 bottom
C18  41.66,5.33 180 top
C19  41.92,9.02 0 bottom
C20  50.94,29.34 270 top
C21  50.94,32.89 90 top
C22  42.81,21.59 90 top
C23  68.84,28.32 180 bottom
C24  60.33,31.75 0 bottom
C25  36.08,25.4 180 bottom
C26  34.55,22.61 270 top
C51  36.58,11.18 90 top
C_FILTER  37.22,7.87 0 top
C_FILTER1  30.11,6.99 270 top
CLK+  73.67,19.18 0 top
CLK-  73.67,20.7 0 top
CONV  48.14,21.59 90 top
CONV1  75.7,12.19 270 top
CONV_A  44.71,9.27 0 top
CONV_T  44.33,26.29 0 top
CONVERSION  60.46,18.67 0 bottom
D+  73.67,17.65 0 top
D-  73.67,16 0 top
DC-DC_CONVERTER  60.46,28.7 180 top
DE_CLK  65.54,1.65 0 top
DE_DATA  70.24,14.1 0 top
DGND  70.37,24.64 0 top
FILTER  27.31,5.59 0 top
FLIP-FLOP  36.33,21.59 0 bottom
GND1  45.22,15.75 0 top
GND2  33.79,1.4 0 top
GND3  45.47,11.94 0 top
GND5  30.11,13.46 0 top
GND_4  48.01,32.38 0 top
GOLD_ORB_SM1  38.74,30.1 180 top
H1  81.98,32.5 0 top
H2  81.98,4.5 0 top
H3  21.98,32.5 0 top
H4  21.98,4.5 0 top
I2C  60.46,18.67 0 top
INSTR_AMP  32.01,10.79 0 top
L1  68.84,32 180 bottom
LED2  34.81,18.5 90 top
MINUS  7.98,9 270 top
MOV1  6.49,18.52 270 top
ON/OFF  74.05,33.02 0 top
PLUS  7.98,28 270 top
POWER  75.19,26.29 180 top
POWER1  29.47,18.5 90 top
R1  33.16,28.83 180 top
R2  76.34,29.08 180 bottom
R3  33.03,17.14 0 bottom
R4  14.74,9.4 90 top
R5  15.63,25.02 90 bottom
R6  69.73,6.1 90 top
R7  69.73,10.16 90 top
R8  33.54,26.8 180 top
R9  67.45,8.13 270 top
R10  37.6,15.11 180 top
R11  30.62,15.62 0 top
R12  41.79,14.86 180 top
R13  30.62,14.22 180 bottom
R14  13.85,6.1 180 bottom
R15  67.45,8.13 90 bottom
R16  69.73,10.16 270 bottom
R17  69.73,6.1 270 bottom
R18  53.22,20.45 90 top
R19  55.38,20.45 90 top
R20  69.1,21.34 90 top
R21  75.45,25.91 180 bottom
R22  68.46,16.64 0 top
R23  29.85,20.19 90 bottom
R53  14.74,12.95 90 bottom
R57  15.63,19.68 90 bottom
R58  14.74,16.26 90 top
R_FILTER  34.43,6.35 90 top
R_FILTER1  32.14,6.99 270 top
REF  37.47,11.18 270 bottom
REF_2.048  34.17,14.22 0 top
RJ45  86.88,18.41 270 top
ROHM_I2C  42.43,30.73 90 bottom
SATURATION_DETECT  37.6,16.38 0 bottom
SCK  48.14,13.21 90 top
SCK_A  45.09,3.3 0 top
SCK_T  45.47,13.84 180 top
SDO  48.14,4.7 90 top
SDO_A  43.57,3.68 0 top
SDO_T  45.09,1.78 180 top
SERIAL_CLOCK  60.33,8.13 0 top
SERIAL_DATA  60.33,8.13 180 bottom
SN74LVC1G32  42.43,21.72 180 bottom
STATUS  40.14,18.5 180 top
TP1  3.06,27.94 0 bottom
TP2  3.06,9.02 0 top
TP3  3.06,27.94 0 top
TP4  3.06,9.02 0 bottom
U$1  15.63,31.24 270 top
U$2  32.9,30.73 270 bottom
U$20  24.9,10.29 90 top
VCC  73.8,22.73 0 top

### Tracks (layer width: path | path; a pad name or v marks a point on that pad's centre or on a via)
0V  (via drill 0.35)
  Top 0.254: DC-DC_CONVERTER.2 66.24,30.04 v66.68,29.59 | POWER.C 81.79,26.29 RJ45.S1 | 0V.TP 68.72,1.91 v68.72,4.02 | 0V_1.TP 65.29,22.61 | 0V_2.TP 65.54,14.61 v66.18,15.24 | 0V_3.TP 72.65,8.38 v73.16,8.89 72.4,9.65 0V_4.TP
  Top 0.508: R7.2 67.62,11.11 | SERIAL_CLOCK.15 v66.46,11.3 67.42,11.3 | v66.46,4.95 66.46,3.84 66.3,3.68 SERIAL_CLOCK.9 | v71.26,20.95 71.26,24.64 DGND.1 68.73,24.64 C6.2 | I2C.5 65.54,16.76 66.18,16.13 v66.18,15.24
  Top 0.635: C7.2 67.62,11.11 67.42,11.3
  Bottom 0.254: C24.1 66.05,31.75 66.68,31.11 v66.68,29.59 67.44,28.83 C23.1 | 70.49,26.29 70.37,26.16 | v68.72,4.02 68.72,4.13 69.65,5.06 | C3.2 67.12,16.13 67.15,16.09
  Bottom 0.508: 67.42,4.95 v66.46,4.95 SERIAL_DATA.15 | 69.65,5.06 67.7,5.06 | 70.37,26.16 DGND.1 | R17.2 70.05,5.15 72.62,7.71 72.62,8.41 74.49,10.29 RJ45.S2 82.04,11.04 v85.23,14.22 85.8,14.8 85.8,22.67 82.04,26.43 RJ45.S1 81.15,27.43 73.41,27.43 72.27,26.29 70.49,26.29 69.47,26.29 69.03,26.73 | v71.26,20.95 71.26,20.32 67.08,16.15 C3.2 66.19,15.24 v66.18,15.24 66.16,15.24 65.02,14.1 SERIAL_DATA.9 66.3,12.57 66.56,12.32 66.56,11.4 v66.46,11.3 | C23.1 69.03,26.73 | 69.03,26.73 69.03,25.79
  Bottom 0.635: 67.42,4.95 67.62,5.15 C9.2 67.7,5.06 | R17.2 69.65,5.06 | CONVERSION.3 65.85,17.4 67.15,16.09
  other vias: 75.07,19.81 78.11,21.84 71.13,5.33 75.7,1.4 86.62,21.97 66.56,35.43 65.41,27.69 77.61,35.43 79.13,28.7 71.89,30.73 77.99,24.51 68.33,24.38 75.45,17.91
  pour Top: 64.65,39.24 93.23,39.24 93.23,-1.27 65.16,-1.27 64.65,-0.76
  pour Bottom: 64.65,39.24 93.23,39.24 93.23,-1.27 65.16,-1.27 64.65,-0.76
+5V  (via drill 0.35)
  Top 0.254: 44.04,7.03 v44.08,6.99 | ADC_.5 42.93,7.03 42.66,6.76 | v32.77,9.99 32.77,10.24 33.32,10.79 INSTR_AMP.8 | 39.63,9.95 C1.1 39.63,10.29 | C26.1 34.08,23.61 v33.3,24.38 | C2.1 35.84,16.38 | C11.1 53.11,13.59 | C20.2 v50.94,28.19 | 55.58,21.4 R19.2 | R18.2 53.35,21.52 53.35,22.61 v53.48,22.73 | v37.85,24 37.85,23.24 | v31.25,21.34 31.4,21.34 32.96,19.74 33.15,19.55 LED2.A
  Top 0.508: SERIAL_CLOCK.7 v57.16,4.95 | ADC_.5 44.04,7.03 | 42.93,7.03 42.64,7.03 42.3,7.37 42.3,8 41.32,8.98 ADC_.1 39.63,9.95 | C18.1 42.66,6.76 | 39.63,10.29 v38.62,9.27 | 37.22,23.24 37.85,23.24 38.62,23.24 v40.21,21.65 41.48,21.65 42.54,20.59 C22.1 43.78,20.59 43.95,20.77 | 35.84,16.38 v35.57,16.38 | 53.11,13.59 v52.08,13.59 | C2.1 36.6,17.41 v37.22,18.03 | U$20.8 22.43,9.02 v21.47,9.02 | C26.1 34.57,23.62 37.22,23.62 37.22,23.24 | 74LVC1G11.5 37.22,23.24 | 43.95,20.77 44.4,21.21 44.4,23.81 v43.06,25.15 39.51,28.7 34.23,28.7 R1.1 33.41,29.52 33.41,29.84 32.03,31.23 C14.1 32.03,31.88 v31.39,32.51 | v43.95,19.94 43.95,20.77 | v51.88,19.36 51.82,19.3 51.82,13.7 C11.1 | DC-DC_CONVERTER.7 51.57,27.7 C20.2 | I2C.1 56.41,20.57 55.58,21.4 | R19.2 R18.2 | C12.1 55.76,12.69 SERIAL_CLOCK.1
  Top 0.635: SERIAL_CLOCK.1 54.76,12.57 53.63,13.7 C11.1
  Bottom 0.254: C5.2 33.16,9.41 32.77,9.79 | v38.62,9.27 38.42,9.46 REF.4 | C13.1 43.3,27.18 | v31.39,32.51 30.9,33.01 U$2.16 | FLIP-FLOP.1 38.32,23.54 v37.85,24 | FLIP-FLOP.4 40.15,21.59 v40.21,21.65 | FLIP-FLOP.13 FLIP-FLOP.14 33.38,23.92 31.62,23.92 31.38,23.68 31.38,21.72 31.5,21.59 | 31.5,21.59 32.15,20.94 FLIP-FLOP.10 32.21,20.94 32.21,19.49 32.75,18.95 34.53,18.95 35.44,18.03 v37.22,18.03 | 31.5,21.59 v31.25,21.34 30.05,21.34 R23.2
  Bottom 0.508: 57.16,9.02 57.16,10.92 56.78,11.3 SERIAL_DATA.7 54.24,11.3 53.86,10.92 52.84,10.92 52.08,11.68 v52.08,13.59 | 57.16,9.02 56.9,8.76 | 56.9,8.76 SERIAL_DATA.5 | SERIAL_DATA.1 55.28,3.32 | 57.16,8.38 57.16,9.02 | 57.16,8.38 v57.16,4.95 57.16,4.15 56.7,3.7 | 56.9,8.76 56.9,8.64 57.16,8.38 | 50.81,27.05 53.48,24.38 v53.48,22.73 C4.1 52.19,19.67 v51.88,19.36 | C15.1 43.82,6.73 v44.08,6.99 44.08,19.81 v43.95,19.94 43.65,20.24 SN74LVC1G32.5 | v32.77,9.99 32.77,9.79 | v21.47,9.02 23,9.02 23.25,9.35 C16.1 24.54,8.13 33.28,8.13 | 33.28,8.13 C5.2 | FLIP-FLOP.14 33.38,24.38 | 33.38,24.38 v33.3,24.38 | v35.57,16.38 SATURATION_DETECT.5 | ROHM_I2C.7 ROHM_I2C.8 44.14,29.02 43.3,28.18 43.3,27.18 43.06,26.94 v43.06,25.15 | 33.28,8.13 37.47,8.13 v38.62,9.27 | 50.81,27.05 50.94,27.05 v50.94,28.19 | 50.81,27.05 48.01,27.05 | 48.01,27.05 C13.1 | +5V.1 48.01,27.05 | C25.1 34.06,24.38 33.38,24.38
  Bottom 0.635: CONVERSION.6 55.56,19.92 53.73,19.92 C4.1 | 55.28,3.32 C10.1 | 56.7,3.7 55.66,3.7 SERIAL_DATA.1
-5V  (via drill 0.35)
  Top 0.254: v31.12,9.53 v31.13,9.54 | 31.13,10.32 30.66,10.79 INSTR_AMP.3 | U$20.3 26.23,10.61 25.42,11.41 C17.2 | -5V.1 49.4,35.43
  Top 0.508: 31.13,10.32 v31.13,9.54 | 50.79,34.04 C21.2 53.27,33.89 DC-DC_CONVERTER.5 | 50.79,34.04 49.4,35.43 | 50.79,34.04 30.87,34.04 27.82,30.99 v27.82,24.13
  Top 0.635: DC-DC_CONVERTER.5 55.42,31.75 v54.24,31.75
  Bottom 0.254: C8.2 30.47,9.53 v31.12,9.53
  Bottom 0.508: C8.2 29.85,8.91 27.68,8.91 26.81,9.78 26.81,10.27 25.66,11.41 C17.2 27.82,13.83 v27.82,24.13 | v54.24,31.75 C24.2
  other vias: 25.41,11.41
>ADC
  Top 0.254: ADC_.4 39.84,7.03 38.22,5.4 37.15,5.4 | 37.15,5.4 ADC_IN.1 36.22,6.33 C_FILTER.1 36.33,7.87 37.98,9.53 37.98,12.83 36.65,14.16 R10.2 35.7,15.11 35.19,15.62 R11.2 | R_FILTER.1 37.15,5.4
CLK+  (via drill 0.35)
  Top 0.254: v71.26,9.91 71.26,8.76 69.73,7.24 R6.2 69.35,7.43 67.69,7.43 R9.2 66.94,7.69 65.21,7.69 SERIAL_CLOCK.12 | CLK+.TP 74.05,18.8 v78.11,18.8
  Bottom 0.254: v71.26,9.91 71.26,10.29 79,18.03 79,18.8 | RJ45.1 82.5,19.91 79.36,19.91 79,19.56 79,18.8 | v78.11,18.8 79,18.8
CLK-  (via drill 0.35)
  Top 0.254: v71.13,11.05 71.13,10.61 R7.1 69.22,8.7 67.83,8.7 R9.1 67,8.64 65.15,8.64 SERIAL_CLOCK.13 | RJ45.2 81.77,20.7 CLK-.TP
  Bottom 0.254: v71.13,11.05 77.35,17.27 77.35,19.68 78.63,20.96 RJ45.2
CLK_DIR  (via drill 0.35)
  Top 0.254: SERIAL_CLOCK.4 55.39,8.51 52.71,8.51 51.06,10.16 51.06,16.28 50.45,16.89 50.45,24.23 48.9,25.78 47.51,25.78 46.39,26.9 46.39,26.96 42.36,30.99 v38.36,30.99
  Bottom 0.254: U$2.4 38.22,31.06 38.29,30.99 v38.36,30.99
CONV  (via drill 0.35)
  Top 0.254: RJ45.5 83.43,16.76 83.43,14.72 81.8,13.08 76.59,13.08 CONV1.TP 74.93,12.19 72.14,14.97 72.14,17.27 70.75,18.67 v67.83,18.67
  Bottom 0.254: v67.83,18.67 CONVERSION.2
CONV_ADC  (via drill 0.35)
  Top 0.254: CONV.1 43.1,19.05 42.43,18.37 v42.43,18.29 42.45,18.27 42.45,17.5 44.08,15.88 44.08,11.68 43.23,10.84 ADC_.8 44.42,8.98 CONV_A.TP
  Bottom 0.254: FLIP-FLOP.5 40.25,20.94 40.38,21.07 SN74LVC1G32.1 41.2,19.51 v42.43,18.29
DATA+
  Top 0.254: D+.TP 74.44,16.89 RJ45.6
  Bottom 0.254: SERIAL_DATA.12 67.13,8.76 R15.2 69.6,9.08 R16.2 69.99,8.96 71.19,8.96 79.12,16.89 RJ45.6
DATA-  (via drill 0.35)
  Top 0.254: D-.TP 74.81,14.86 78.11,14.86 v78.08,14.89
  Bottom 0.254: SERIAL_DATA.13 65.08,7.43 67.19,7.43 R15.1 67.58,7.05 R17.1 70.24,7.05 v78.08,14.89 79.09,15.9 82.56,15.9 83.43,16.77 83.43,18.8 RJ45.3
DATA_DIR  (via drill 0.35)
  Top 0.254: v53.99,7.49 53.09,7.49 50.66,9.93 50.66,16.11 50.05,16.72 50.05,22.3 49.59,22.76 47.16,22.76 45.98,23.93 45.98,26.8 42.55,30.23 v37.98,30.23
  Bottom 0.254: SERIAL_DATA.4 v53.99,7.49 | U$2.5 37.8,30.41 v37.98,30.23
DGND  (via drill 0.35)
  Top 0.254: 39.94,7.68 ADC_.3 | 22.73,10.03 U$20.7 | C51.2 36.26,12.45 | 41.17,22.37 SN74LVC1G32.3 42.58,22.37 C22.2 | C1.2 39.38,12.51 | 39.64,16.11 39.36,16.38 | U$20.4 26.93,11.26 | v31.12,11.18 31,11.29 INSTR_AMP.2 INSTR_AMP.1 | GND5.TP 31.76,13.46 32.84,12.38 32.9,12.32 | GND2.TP 35.95,3.56 40.66,3.56 | v46.74,17.27 45.98,17.27 45.22,16.51 GND1.TP 44.48,15.01 44.48,12.93 GND3.TP | C11.2 53.62,11.3 | GND_4.1 48.51,31.89 C21.1 | 27.9,9.96 27.75,10.11 25.9,10.11 | 28.2,9.66 v28.17,9.62 | 37.09,21.21 36.71,21.21 | POWER1.C 29.48,17.28 v29.28,17.08 | 40.78,16.11 40.14,16.74 STATUS.C
  Top 0.406: v21.47,10.03 22.73,10.03 | U$20.7 24.2,9.96
  Top 0.508: 53.62,11.3 SERIAL_CLOCK.2 | SERIAL_CLOCK.5 SERIAL_CLOCK.6 54.49,6.22 53.53,5.26 C10.2 52.59,5.32 52.01,5.9 | C20.1 C21.1 48.65,31.89 47.27,33.27 31.16,33.27 30.49,32.6 30.49,26.16 31.25,25.4 31.76,25.4 31.76,23.88 31.38,23.5 31.38,22.93 32.7,21.61 C26.2 35.43,21.61 35.82,21.21 36.71,21.21 36.97,21.21 | 39.94,7.68 v39.89,7.62 39.63,7.62 39.38,7.87 C_FILTER.2 | ADC_.3 41.23,7.68 41.54,7.37 41.54,6.21 C18.2 40.66,3.56 40.66,2.4 42.43,0.64 49.79,0.64 50.3,1.14 50.3,3.68 | 36.26,12.45 v35.31,12.45 32.9,12.45 32.84,12.38 | 41.17,22.37 39.38,24.16 v39.38,25.4 31.38,25.4 | v39,19.05 39,20.07 38.49,20.57 37.73,20.57 37.22,21.08 | v39.38,13.72 39.38,12.51 | C2.2 39.36,16.38 v39.63,16.38 | 26.93,11.26 v26.93,11.94 26.93,11.98 | C20.1 49.9,30.34 49.67,30.1 49.67,27.3 52.08,24.89 52.08,23.37 v52.52,22.92 52.52,22.8 | v51.06,20.07 v51.06,17.4 | 24.2,9.96 24.74,9.41 C17.1 25.96,9.96 U$20.2 27.9,9.96 28.2,9.66 28.2,7.11 29.33,5.99 C_FILTER1.2 | v34.54,32.51 34.54,31.88 C14.2 | v32.27,11.68 32.9,12.32 | 52.01,5.9 50.94,6.97 v50.94,8.26 | v51.98,10.06 53.22,11.3 C11.2 | 52.01,5.9 50.3,4.19 50.3,3.68 | SERIAL_CLOCK.8 50.3,3.68 | DC-DC_CONVERTER.6 51.57,29.7 C20.1 | I2C.4 55.87,16.76 C12.2 55.14,16.88 v54.62,17.4 | 37.22,21.08 37.09,21.21 | 74LVC1G11.2 37.22,21.08 | R12.1 42.74,15.81 42.45,16.11 40.78,16.11 39.64,16.11
  Top 0.813: MINUS.1 8.01,9.03 8.01,14.59 MOV1.2 | TP4.TP 3.04,9 2.92,9
  Top 1.27: 2.92,9 MINUS.1
  Bottom 0.254: C15.2 40.78,6.73 | 33.01,11.68 C5.1 | v31.12,11.18 30.89,11.41 C8.1 30.49,11.54 | 32.12,11.54 v32.27,11.68 | v35.31,12.45 v35.33,12.46 | 37.47,11.94 REF.2 | 39.28,19.34 v39,19.05 | v46.74,17.27 50.94,17.27 v51.06,17.4 51.33,17.67 | U$2.1 35.87,32.38 | 34.66,32.38 v34.54,32.51 | R13.1 29.22,14.67 29.22,17.02 v29.28,17.08
  Bottom 0.508: SERIAL_DATA.2 55.28,5.32 C10.2 | CONVERSION.4 54.38,16.2 54.38,13.84 SERIAL_DATA.8 54.09,12.57 C11.2 | 40.78,6.73 v39.89,7.62 39.51,7.62 39.12,8 39.12,8.64 39.76,9.27 39.76,10.67 39.12,11.3 38.11,11.3 37.47,11.94 | v32.27,11.68 33.01,11.68 | 32.12,11.54 30.49,11.54 | C16.2 22.87,11.41 v21.49,10.03 v21.47,10.03 20.89,10.03 17.27,6.41 17.27,5.69 16.01,4.43 13.34,4.43 12.9,4.87 R14.1 | v35.33,12.46 REF.1 REF.2 37.47,12.83 38.36,13.72 v39.38,13.72 40.39,13.72 40.65,13.97 40.65,15.37 v39.63,16.38 SATURATION_DETECT.2 | 39.28,19.34 FLIP-FLOP.7 | C13.2 41.3,28.18 40.46,29.02 ROHM_I2C.1 | ROHM_I2C.1 ROHM_I2C.2 ROHM_I2C.3 ROHM_I2C.4 39.52,33.01 U$2.1 U$2.2 U$2.3 | 28.2,11.41 C8.1 30.36,13.53 R13.1 | 28.2,11.41 27.46,11.41 v26.93,11.94 | C4.2 51.33,17.67 | ROHM_I2C.1 38.87,29.02 38.08,28.23 | 38.08,28.23 39.38,26.92 v39.38,25.4 C25.2 | C19.1 42.05,8.14 42.05,7.6 C15.2 | v51.06,20.07 51.06,21.46 v52.52,22.92 | v50.94,8.26 50.94,9.02 v51.98,10.06 | U$2.8 37.84,28.46 38.08,28.23 | 35.87,32.38 34.66,32.38 | v28.17,9.62 28.17,11.38 28.2,11.41
  Bottom 0.635: R14.1 11,6.1 8.04,9.05 8.03,9.05 MINUS.1 | CONVERSION.4 v54.62,17.4 53.75,17.4 C4.2
  Bottom 1.27: TP4.TP 2.92,9 MINUS.1
  other vias: 41.2,22.37 25.41,9.41 53.22,11.7 53.48,5.32 51.19,4.83 51.82,1.65 39.38,2.16 30.11,3.81 27.57,1.02 29.6,33.91 53.48,35.31 41.54,32.26 55,25.53 27.69,33.4 37.35,27.43 46.74,14.48 49.41,14.48 41.28,28.83
  pour Bottom: 27.19,37.47 27.19,14.35 20.58,7.75 20.58,-1.14 56.4,-1.14 56.4,37.47
  pour Top: 27.19,37.47 27.19,14.35 20.58,7.75 20.58,-1.14 56.4,-1.14 56.4,37.47
GAIN_LSB  (via drill 0.35)
  Top 0.254: INSTR_AMP.4 28.96,10.29 28.73,10.52 28.73,12.3 28.08,12.95 28.08,21.34 29.85,23.11 29.85,26.99 v29.29,27.56
  Bottom 0.254: v29.29,27.56 28.65,28.19 28.65,29.76 U$2.11
GAIN_MSB  (via drill 0.35)
  Top 0.254: INSTR_AMP.5 28.81,9.79 28.33,10.28 28.33,12 27.67,12.66 27.67,21.88 29.35,23.56 29.35,26.29 28.71,26.92 v28.71,30.35
  Bottom 0.254: v28.71,30.35 28.77,30.41 U$2.12
INPUT_ZERO  (via drill 0.35)
  Top 0.254: v28.71,23.75 27.19,22.23 27.19,13.21 26.12,12.14 25.23,12.14 24.35,11.26 U$20.5
  Bottom 0.254: U$2.9 29.93,27.26 28.71,26.04 v28.71,23.75
N$1
  Top 0.254: R_FILTER.2 34.43,8.13 35.31,9.02 35.31,10.03 35.05,10.29 INSTR_AMP.7
N$2  (via drill 0.35)
  Top 0.254: v31.38,30.1 32.21,29.27 R1.2
  Bottom 0.254: U$2.13 30.8,31.06 31.38,30.48 v31.38,30.1
N$3
  Top 0.254: SERIAL_CLOCK.10 65.65,5.59 67.95,5.59 68.08,5.46 68.08,4.19 DE_CLK.1
N$4  (via drill 0.35)
  Top 0.254: I2C.3 53.86,18.03 53.22,18.67 R18.1 52.55,19.5 52.11,19.93 52.01,19.93 51.55,20.4 51.55,21.29 50.98,21.85 50.98,24.4 49,26.38 47.67,26.38 43.82,30.23 v43.82,31.62
  Bottom 0.254: v43.82,31.62 45.09,31.62 ROHM_I2C.6 43.89,31.56 41.66,33.78 32.52,33.78 32.11,33.37 32.11,32.03 31.79,31.71 U$2.14
N$5
  Top 0.254: U$20.1 27.08,5.95 27.41,5.62 27.34,5.62 FILTER.1 27.95,5.59 28.96,4.57 31.89,4.57 32.14,4.83 R_FILTER1.2
N$6  (via drill 0.35)
  Top 0.254: v43.82,32.45 44.46,31.81 44.46,30.16 47.59,27.03 49.01,27.03 51.44,24.59 51.44,22.73 51.95,22.23 51.95,20.88 52.36,20.47 54.41,20.47 R19.1 55.57,19.5 55.76,19.3 I2C.2
  Bottom 0.254: U$2.15 28.81,32.36 28.58,32.58 28.58,34.16 29.22,34.8 41.41,34.8 43.76,32.45 v43.82,32.45 44.2,32.83 ROHM_I2C.5
N$7  (via drill 0.35)
  Top 0.254: DE_DATA.1 68.08,14.1 v67.83,14.35
  Bottom 0.254: SERIAL_DATA.10 65.65,10.67 67.24,10.67 67.83,11.25 v67.83,14.35
N$8  (via drill 0.35)
  Top 0.254: v39.89,8.38 39.9,8.37 40.56,8.37 ADC_.2
  Bottom 0.254: v39.89,8.38 40.28,8.38 C19.2 40.92,10.65 42.05,11.78 ADC_REF.1
N$9  (via drill 0.35)
  Top 0.813: U$1.P$2 15.88,25.65 13.6,23.37 13.6,22.35 12.58,21.34 3.86,21.34 MOV1.1
  Bottom 0.508: U$1.P$2 15.88,26.7 R5.2
  other vias: 15.88,27.3
N$10  (via drill 0.35)
  Top 0.254: L1.1
  Top 0.508: DC-DC_CONVERTER.1 67.4,31.7 L1.1
  other vias: 67.69,32
N$11
  Bottom 0.61: ON/OFF.3 76.59,29.78 R2.2
N$12
  Top 0.254: ON/OFF.2 74.05,30.78 68.97,25.7 DC-DC_CONVERTER.4
N$13  (via drill 0.35)
  Top 0.254: SCK.3 48.14,17.53 47.76,17.91 43.7,17.91 v43.25,18.35 | 74LVC1G11.4 38.17,21.53 38.36,21.34 39,21.34 39.38,20.95 40.78,20.95 41.73,20 41.73,19.82 42.07,19.49 v42.55,19.49
  Bottom 0.254: v42.55,19.49 42.55,19.04 v43.25,18.35
N$14  (via drill 0.35)
  Top 0.254: v32.77,16.51 34.13,17.87 LED2.C
  Bottom 0.254: R3.2 32.71,16.51 v32.77,16.51
N$15
  Top 0.254: C_FILTER1.1 32.09,7.99 R_FILTER1.1 32.14,10.29 32.39,10.54 32.39,10.87 33.32,11.79 INSTR_AMP.10
N$16
  Top 0.635: U$1.P$1 15.12,35.31 10.17,35.31 7.98,33.11 PLUS.1
  Top 1.27: PLUS.1 3.12,28 TP1.TP
  Bottom 1.27: TP1.TP 3.12,28 PLUS.1
N$17  (via drill 0.35)
  Top 0.254: v37.76,15.38 37.87,15.28 37.89,15.28 38.06,15.11 R10.1 38.68,15.24 40.46,15.24 R12.2
  Bottom 0.254: SATURATION_DETECT.4 37.72,15.43 v37.76,15.38
N$18  (via drill 0.35)
  Top 0.254: R11.1 v29.92,15.88
  Bottom 0.254: v29.92,15.88 R13.2 31.57,14.48 32.9,15.81 34.74,15.81 35.82,14.73 37.99,14.73 38.78,15.53 SATURATION_DETECT.3
N$19  (via drill 0.35)
  Top 0.254: v32.14,23.24 32.77,22.61 36.27,22.61 74LVC1G11.6 36.2,22.17 v36.2,22.73
  Bottom 0.254: v32.14,23.24 32.14,22.61 32.51,22.24 FLIP-FLOP.12 | FLIP-FLOP.6 38.27,20.29 37.85,20.7 37.85,21.08 v36.2,22.73
N$20  (via drill 0.35)
  Top 0.254: U$20.6 22.49,10.61 21.03,10.61 18.4,7.98 R4.1 14.74,4.95 15.12,4.57 ANALOG_IN.TP 16.9,3.05 A_IN.1
  Bottom 0.508: R4.1 14.74,6.16 R14.2
  other vias: 14.74,7.98
N$21  (via drill 0.35)
  Bottom 0.508: R57.1 15.02,17.65 14.74,17.65 R58.2
  other vias: 14.74,17.68
N$22  (via drill 0.35)
  Top 0.254: v30.94,24.38 30.81,24.26 30.81,22.7 32.54,20.97 33.34,20.97 33.64,20.68 35.31,20.68 35.7,20.3 35.7,18.92 35.95,18.67 37.47,18.67 37.73,18.41 40.01,18.41 40.14,18.54 STATUS.A
  Bottom 0.254: R8.1 33.09,25.4 32.01,25.4 31,24.38 v30.94,24.38
  other vias: 34.49,26.8
N$23  (via drill 0.35)
  Top 0.254: 74LVC1G11.3 38.04,19.43 v38.04,19.11
  Bottom 0.254: v38.04,19.11 37.92,18.98 35.89,18.98 34.58,20.29 FLIP-FLOP.9
N$24
  Top 0.254: CONV_T.TP 44.33,24.77 47.51,21.59 CONV.2
  Bottom 0.254: CONVERSION.5 51.22,18.67 48.3,21.59 CONV.2
N$25
  Bottom 0.254: CONV.3 47.57,24.13 47.35,23.91 40.93,23.91 39.92,22.89 FLIP-FLOP.2
N$26
  Top 0.254: SCK.2 46.24,11.3 46.24,8.64 45.93,8.33 45.73,8.33 | ADC_.7 45.73,8.33 | SCK_A.TP 45.73,3.94 45.73,8.33
N$27  (via drill 0.35)
  Top 0.254: POWER1.A 29.85,19.93 v30.49,19.93
  Bottom 0.254: v30.49,19.93 30.49,19.88 R23.1
N$29  (via drill 0.35)
  Top 0.508: R53.1 R4.2
  other vias: 14.74,11.53
N$30
  Top 0.254: SDO_T.TP 48.01,4.7 SDO.2
  Bottom 0.254: SDO.2 48.9,4.7 54.29,10.08 55.6,10.08 SERIAL_DATA.6
N$31
  Bottom 0.254: SDO.3 47.63,7.24 45.35,9.53 45.35,21.73 44.71,22.37 SN74LVC1G32.4
N$32  (via drill 0.35)
  other vias: 73.54,5.08
N$53  (via drill 0.35)
  Top 0.254: POWER.A 73.8,26.29 v73.41,25.91
  Bottom 0.254: v73.41,25.91 R21.1
N$66  (via drill 0.35)
  Top 0.508: R58.1 R53.2
  other vias: 14.74,14.38
N$67
  Bottom 0.508: R5.1 R57.2
N_WE  (via drill 0.35)
  Top 0.254: INSTR_AMP.6 34.18,9.29 33.28,8.38 33.28,7.24 33.03,6.99 29.22,6.99 28.84,7.37 28.84,8.56 29.19,8.91 31.38,8.91 31.74,9.27 31.74,11.4 30.69,12.45 29.35,12.45 28.58,13.21 28.58,20.57 30.23,22.23 v30.23,22.48
  Bottom 0.254: v30.23,22.48 30.23,24.77 34.58,29.11 U$2.7
REF_  (via drill 0.35)
  Top 0.254: INSTR_AMP.9 35.26,11.29 36.46,10.1 | v36.46,9.27 36.46,10.1 | 36.46,10.1 C51.1
  Bottom 0.254: REF.6 36.52,9.34 | 36.52,9.34 v36.46,9.27 | REF_2.048.1 34.55,13.84 34.55,11.31 36.52,9.34
SAT_DETECT
  Bottom 0.254: R3.1 34.17,17.33 SATURATION_DETECT.6 | SATURATION_DETECT.6 SATURATION_DETECT.1 | U$2.10 30.84,29.11 31.25,28.7 31.25,27.81 29.66,26.22 29.66,23.5 28.58,22.42 28.58,18.72 29.08,18.22 32.84,18.22 33.73,17.33 SATURATION_DETECT.6
SCK_ADC  (via drill 0.35)
  Top 0.254: SCK_T.TP 45.47,13.72 v46.11,13.08 | v36.33,20.45 36.33,19.61 74LVC1G11.1 | SERIAL_CLOCK.3 53.35,10.03 v53.22,10.16
  Bottom 0.254: v36.33,20.45 35.19,20.45 34.93,20.7 34.93,21.59 | 34.93,21.59 34.93,22.61 35.64,23.32 36.94,23.32 38.01,22.24 FLIP-FLOP.3 39.91,22.24 41.03,23.36 44.59,23.36 45.98,21.97 45.98,13.21 v46.11,13.08 46.11,12.06 47.51,10.67 SCK.1 52.19,10.67 52.69,10.16 v53.22,10.16 | FLIP-FLOP.11 34.93,21.59
SCL
  Top 0.254: RJ45.7 84.58,14.46 82.56,12.45 77.61,12.45 76.34,11.18 74.94,11.18 71.74,14.37 71.74,16.91 70.62,18.03 67.45,18.03 | 67.45,18.03 I2C.6 | R22.1 67.45,16.7 67.45,18.03
SDO
  Top 0.254: RJ45.8 81.16,13.97 73.9,13.97 72.63,15.24 72.63,17.74 69.99,20.39 R20.1 68.01,19.3 I2C.7
SDO_ADC  (via drill 0.35)
  Top 0.254: ADC_.6 45.09,7.68 v45.09,7.62 45.09,5.21 SDO_A.TP
  Bottom 0.254: SN74LVC1G32.2 42.05,21.72 42.3,21.72 42.43,21.72 44.33,21.72 44.71,21.34 44.71,8 v45.09,7.62 45.09,3.3 46.24,2.16 SDO.1
STATUS_LED  (via drill 0.35)
  Top 0.254: R8.2 31.63,26.8 v31.38,27.05
  Bottom 0.254: v31.38,27.05 34.09,29.76 U$2.6
V+  (via drill 0.35)
  Top 0.254: R20.2 68.52,22.29 67.06,20.83 v67.06,19.94 | R22.2 69.41,15.94 68.72,15.24 67.57,15.24 67.06,14.73 67.06,13.32 C7.1
  Top 0.508: 65.04,12.56 67.06,12.56 C7.1 67.8,12.59 69.08,12.59 v69.1,12.57 71.26,12.57 74.05,9.78 v74.05,8.64 | RJ45.4 83.31,20.2 83.31,21.46 82.04,22.73 VCC.1 72.53,24 v72.53,27.94 | I2C.8 63.05,20.7 67.06,20.7 | C6.1 67.06,20.7 | 67.06,20.7 v67.06,19.94
  Top 0.635: v69.73,3.3 R6.1 | SERIAL_CLOCK.16 65.04,12.56
  Bottom 0.254: VCC.1 74.94,23.88 75.51,23.88 76.4,24.77 R21.2
  Bottom 0.508: SERIAL_DATA.16 67.08,3.68 C9.1 69.73,3.32 | R16.1 69.1,11.74 v69.1,12.57 68.72,12.95 68.72,15.76 C3.1 69.97,16.13 73.8,19.95 VCC.1 69.86,22.73 v67.06,19.94 CONVERSION.1 | L1.2 69.99,28.57 | 70.62,27.94 v72.53,27.94 73.67,29.08 R2.1 | v74.05,8.64 74.05,7.11 70.24,3.3 v69.73,3.3
  Bottom 0.61: C23.2 70.62,27.94
  Bottom 0.635: 69.99,28.57 C23.2 | 69.73,3.32 v69.73,3.3

### Text on the board
tNames: GND | 0V | 100mA, 250V | 0V | OL | ST | GND | PWR | 0V | 2022_10_08 | VILLASsensor V0.2 | M. Pitz; N. Eiling | GND | GND | 0V | 0V | GND
bNames: PLUS | MINUS
tDocu: https://de.rs-online.com/web/p/led-lichtleiter/8796453 | Power led weiter links (oder über den lan port) | Jumper für I2C und CONV durch testpads ersetzen | Rechte Holes weiter rein | Sicherungen und abständer an + prüfen | Lan port 3mm raus ✓
bReserve: ROHM_I2C